# EAGLE schematic DUE3DOM MINI rev2 21022017-1546 (EAGLE 7.5.0)
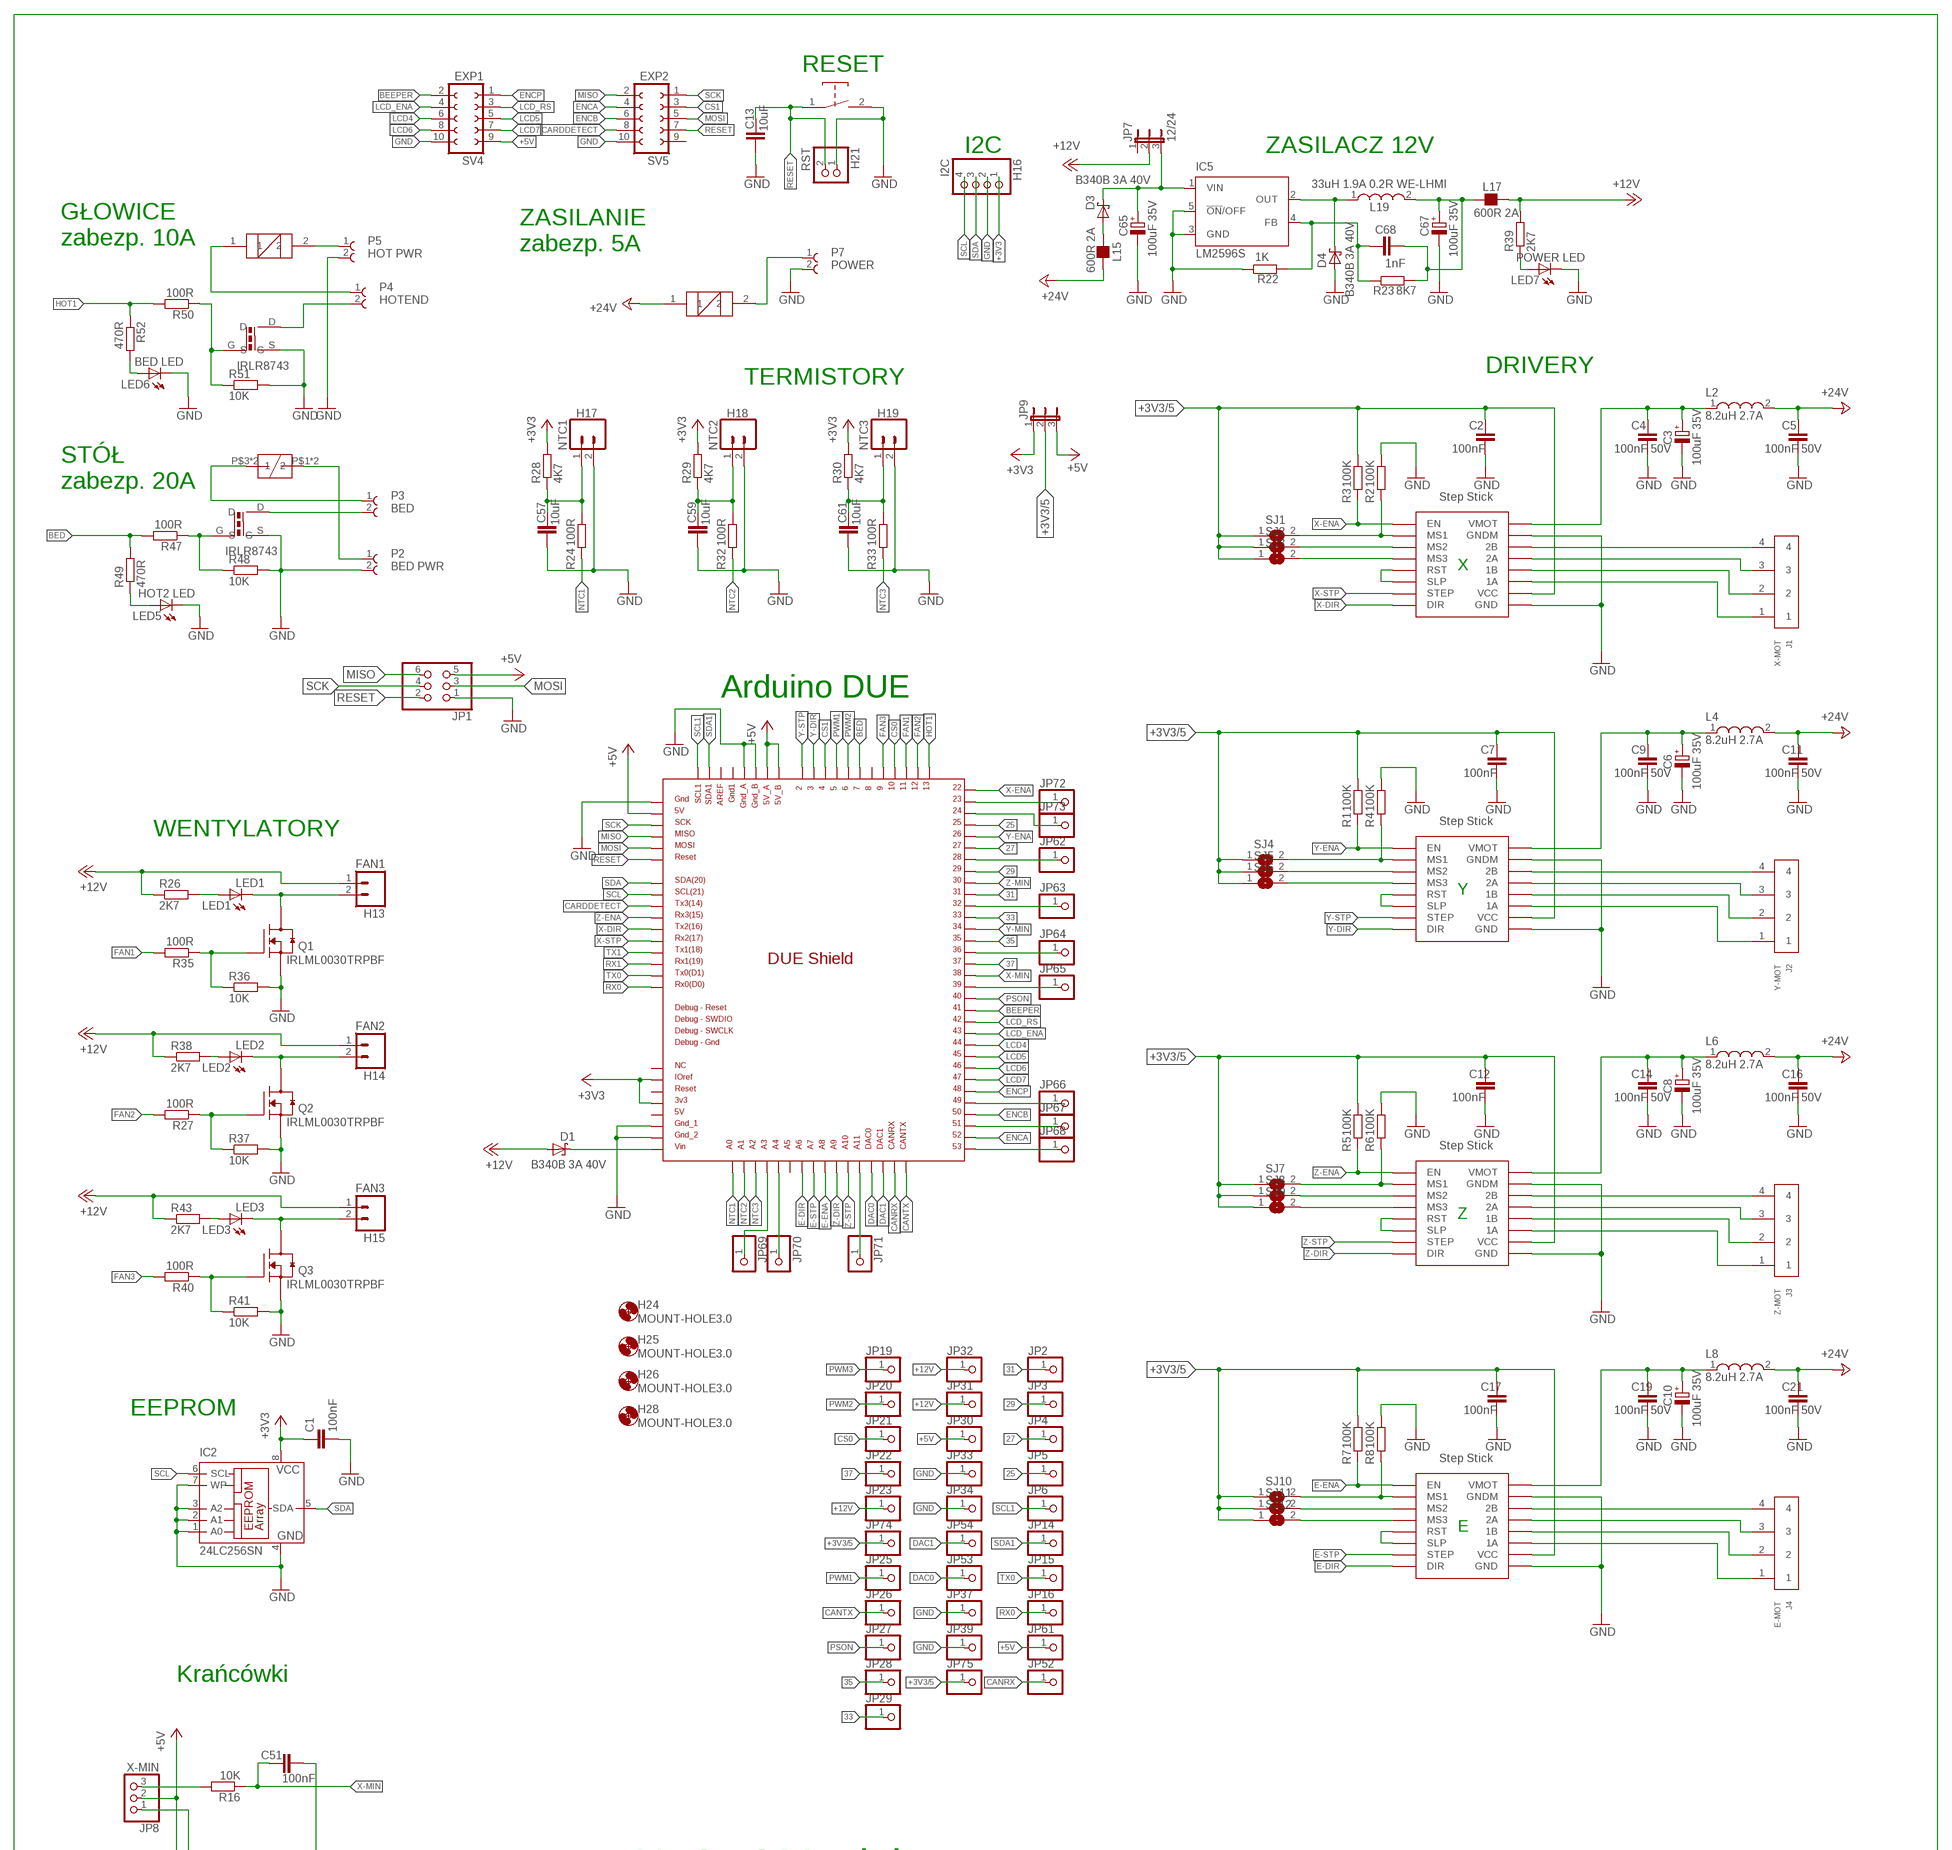
[diagram p0: schematic, sheet 1, part 1 of 2]
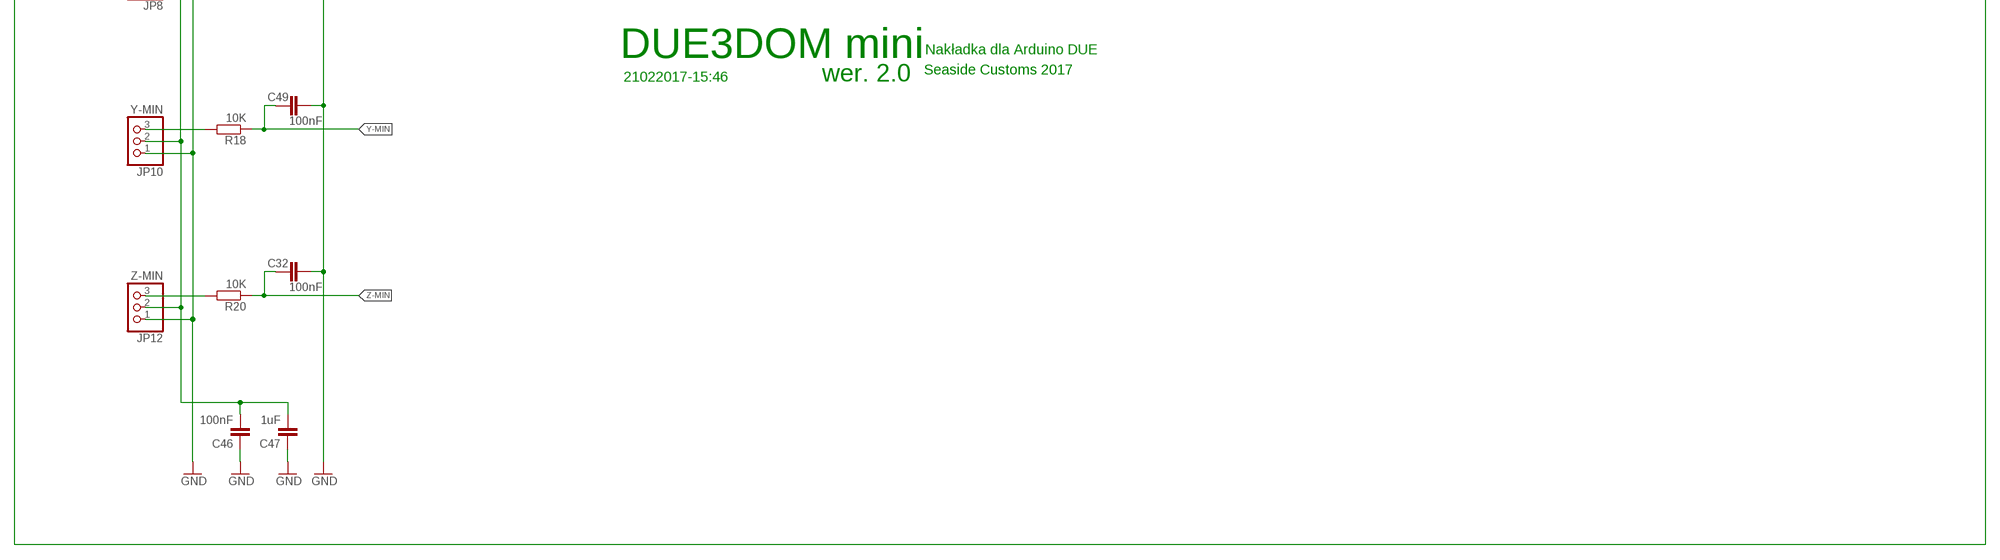
[diagram p1: schematic, sheet 1, part 2 of 2]

## Parts
C1  100nF  C-EUC0805  [C0805]
C2  100nF  C-EUC0805  [C0805]
C3  100uF 35V  CPOL-EUD  [PANASONIC_D]
C4  100nF 50V  C-EUC0805  [C0805]
C5  100nF 50V  C-EUC0805  [C0805]
C6  100uF 35V  CPOL-EUD  [PANASONIC_D]
C7  100nF  C-EUC0805  [C0805]
C8  100uF 35V  CPOL-EUD  [PANASONIC_D]
C9  100nF 50V  C-EUC0805  [C0805]
C10  100uF 35V  CPOL-EUD  [PANASONIC_D]
C11  100nF 50V  C-EUC0805  [C0805]
C12  100nF  C-EUC0805  [C0805]
C13  10uF  C-EUC0805  [C0805]
C14  100nF 50V  C-EUC0805  [C0805]
C16  100nF 50V  C-EUC0805  [C0805]
C17  100nF  C-EUC0805  [C0805]
C19  100nF 50V  C-EUC0805  [C0805]
C21  100nF 50V  C-EUC0805  [C0805]
C32  100nF  C-EUC0805  [C0805]
C46  100nF  C-EUC0805  [C0805]
C47  1uF  C-EUC0805  [C0805]
C49  100nF  C-EUC0805  [C0805]
C51  100nF  C-EUC0805  [C0805]
C57  10uF  C-EUC0805  [C0805]
C59  10uF  C-EUC0805  [C0805]
C61  10uF  C-EUC0805  [C0805]
C65  100uF 35V  CPOL-EUE2.5-6  [E2,5-6]
C67  100uF 35V  CPOL-EUE2.5-6  [E2,5-6]
C68  1nF  C-EUC0805  [C0805]
D1  B340B 3A 40V  SCHOTTKY-DIODESMD  [SMB]
D3  B340B 3A 40V  SCHOTTKY-DIODESMD  [SMB]
D4  B340B 3A 40V  SCHOTTKY-DIODESMD  [SMB]
FET1  DPAK_N-CHANNEL_MOSFET  [DPAK_N-CHANNEL_MOSFET]
FET2  DPAK_N-CHANNEL_MOSFET  [DPAK_N-CHANNEL_MOSFET]
FUSE  GNIAZDO_BEZPIECZNIKA_MINI_CHRL  [FUSE_MINI_CHRL]
H13  FAN1  M02POLAR  [MOLEX-1X2]
H14  FAN2  M02POLAR  [MOLEX-1X2]
H15  FAN3  M02POLAR  [MOLEX-1X2]
H16  I2C  PINHD-1X4  [1X04]
H17  NTC1  M02POLAR  [MOLEX-1X2]
H18  NTC2  M02POLAR  [MOLEX-1X2]
H19  NTC3  M02POLAR  [MOLEX-1X2]
H21  RST  PINHD-1X2  [1X02]
H24  MOUNT-HOLE3.0  [3,0]
H25  MOUNT-HOLE3.0  [3,0]
H26  MOUNT-HOLE3.0  [3,0]
H28  MOUNT-HOLE3.0  [3,0]
IC2  24LC256SN  [SO-08]
IC5  LM2596S  [TO263-5]
J1  X-MOT  66100411622  [66100411622]
J2  Y-MOT  66100411622  [66100411622]
J3  Z-MOT  66100411622  [66100411622]
J4  E-MOT  66100411622  [66100411622]
JP1  PINHD-2X3  [2X03]
JP2  PINHD-1X1  [1X01]
JP3  PINHD-1X1  [1X01]
JP4  PINHD-1X1  [1X01]
JP5  PINHD-1X1  [1X01]
JP6  PINHD-1X1  [1X01]
JP7  12/24  JP2E  [JP2]
JP8  X-MIN  PINHD-1X3  [1X03]
JP9  JP2E  [JP2]
JP10  Y-MIN  PINHD-1X3  [1X03]
JP12  Z-MIN  PINHD-1X3  [1X03]
JP14  PINHD-1X1  [1X01]
JP15  PINHD-1X1  [1X01]
JP16  PINHD-1X1  [1X01]
JP19  PINHD-1X1  [1X01]
JP20  PINHD-1X1  [1X01]
JP21  PINHD-1X1  [1X01]
JP22  PINHD-1X1  [1X01]
JP23  PINHD-1X1  [1X01]
JP25  PINHD-1X1  [1X01]
JP26  PINHD-1X1  [1X01]
JP27  PINHD-1X1  [1X01]
JP28  PINHD-1X1  [1X01]
JP29  PINHD-1X1  [1X01]
JP30  PINHD-1X1  [1X01]
JP31  PINHD-1X1  [1X01]
JP32  PINHD-1X1  [1X01]
JP33  PINHD-1X1  [1X01]
JP34  PINHD-1X1  [1X01]
JP37  PINHD-1X1  [1X01]
JP39  PINHD-1X1  [1X01]
JP52  PINHD-1X1  [1X01]
JP53  PINHD-1X1  [1X01]
JP54  PINHD-1X1  [1X01]
JP61  PINHD-1X1  [1X01]
JP62  PINHD-1X1  [1X01]
JP63  PINHD-1X1  [1X01]
JP64  PINHD-1X1  [1X01]
JP65  PINHD-1X1  [1X01]
JP66  PINHD-1X1  [1X01]
JP67  PINHD-1X1  [1X01]
JP68  PINHD-1X1  [1X01]
JP69  PINHD-1X1  [1X01]
JP70  PINHD-1X1  [1X01]
JP71  PINHD-1X1  [1X01]
JP72  PINHD-1X1  [1X01]
JP73  PINHD-1X1  [1X01]
JP74  PINHD-1X1  [1X01]
JP75  PINHD-1X1  [1X01]
L2  8.2uH 2.7A  WE-PD_7332/7345_PLASTIC_BASE  [WE-PD_7332/7345_PLASTIC_BASE]
L4  8.2uH 2.7A  WE-PD_7332/7345_PLASTIC_BASE  [WE-PD_7332/7345_PLASTIC_BASE]
L6  8.2uH 2.7A  WE-PD_7332/7345_PLASTIC_BASE  [WE-PD_7332/7345_PLASTIC_BASE]
L8  8.2uH 2.7A  WE-PD_7332/7345_PLASTIC_BASE  [WE-PD_7332/7345_PLASTIC_BASE]
L15  600R 2A  FB_1206  [L1206]
L17  600R 2A  FB_1206  [L1206]
L19  33uH 1.9A 0.2R WE-LHMI  WE-LHMI_7030/7050  [WE-LHMI_7030/7050]
LED1  LED1  LED_0805_BIVAR_VLP-250-F  [LED_0805_BIVAR_VLP-250-F]
LED2  LED2  LED_0805_BIVAR_VLP-250-F  [LED_0805_BIVAR_VLP-250-F]
LED3  LED3  LED_0805_BIVAR_VLP-250-F  [LED_0805_BIVAR_VLP-250-F]
LED5  HOT2 LED  LED_0805_BIVAR_VLP-250-F  [LED_0805_BIVAR_VLP-250-F]
LED6  BED LED  LED_0805_BIVAR_VLP-250-F  [LED_0805_BIVAR_VLP-250-F]
LED7  POWER LED  LED_0805_BIVAR_VLP-250-F  [LED_0805_BIVAR_VLP-250-F]
P2  BED PWR  691241710002  [691241710002]
P3  BED  691241710002  [691241710002]
P4  HOTEND  691241710002  [691241710002]
P5  HOT PWR  691241710002  [691241710002]
P7  POWER  691241710002  [691241710002]
Q1  IRLML0030TRPBF  MOSFET-NCH_SOT-23  [SOT95P280X135-3N]
Q2  IRLML0030TRPBF  MOSFET-NCH_SOT-23  [SOT95P280X135-3N]
Q3  IRLML0030TRPBF  MOSFET-NCH_SOT-23  [SOT95P280X135-3N]
R1  100K  R-EU_R0805  [R0805]
R2  100K  R-EU_R0805  [R0805]
R3  100K  R-EU_R0805  [R0805]
R4  100K  R-EU_R0805  [R0805]
R5  100K  R-EU_R0805  [R0805]
R6  100K  R-EU_R0805  [R0805]
R7  100K  R-EU_R0805  [R0805]
R8  100K  R-EU_R0805  [R0805]
R16  10K  R-EU_R0805  [R0805]
R18  10K  R-EU_R0805  [R0805]
R20  10K  R-EU_R0805  [R0805]
R22  1K  R-EU_R0805  [R0805]
R23  8K7  R-EU_R0805  [R0805]
R24  100R  R-EU_R0805  [R0805]
R26  2K7  R-EU_R0805  [R0805]
R27  100R  R-EU_R0805  [R0805]
R28  4K7  R-EU_R0805  [R0805]
R29  4K7  R-EU_R0805  [R0805]
R30  4K7  R-EU_R0805  [R0805]
R32  100R  R-EU_R0805  [R0805]
R33  100R  R-EU_R0805  [R0805]
R35  100R  R-EU_R0805  [R0805]
R36  10K  R-EU_R0805  [R0805]
R37  10K  R-EU_R0805  [R0805]
R38  2K7  R-EU_R0805  [R0805]
R39  2K7  R-EU_R0805  [R0805]
R40  100R  R-EU_R0805  [R0805]
R41  10K  R-EU_R0805  [R0805]
R43  2K7  R-EU_R0805  [R0805]
R47  100R  R-EU_R0805  [R0805]
R48  10K  R-EU_R0805  [R0805]
R49  470R  R-EU_R0805  [R0805]
R50  100R  R-EU_R0805  [R0805]
R51  10K  R-EU_R0805  [R0805]
R52  470R  R-EU_R0805  [R0805]
RESET  RESET  WIDE_TACT  [WIDE_TACT]
SJ1  SJ  [SJ]
SJ2  SJ  [SJ]
SJ3  SJ  [SJ]
SJ4  SJ  [SJ]
SJ5  SJ  [SJ]
SJ6  SJ  [SJ]
SJ7  SJ  [SJ]
SJ8  SJ  [SJ]
SJ9  SJ  [SJ]
SJ10  SJ  [SJ]
SJ11  SJ  [SJ]
SJ12  SJ  [SJ]
STEPSTICK-X  STEP-STICK  [STEP-STICK]
STEPSTICK-Y  STEP-STICK  [STEP-STICK]
STEPSTICK-Z1  STEP-STICK  [STEP-STICK]
STEPSTICK-Z2  STEP-STICK  [STEP-STICK]
SV4  EXP1  FE05-2  [FE05-2]
SV5  EXP2  FE05-2  [FE05-2]
U$1  DUE(NORMAL)  [DUE(NORMAL)]
U$2  FUSE_1808  [FUSE_1808]
U$3  FUSE_1808  [FUSE_1808]

## Nets
25: JP5.1 U$1.25
27: JP4.1 U$1.27
29: JP3.1 U$1.29
31: JP2.1 U$1.31
33: JP29.1 U$1.33
35: JP28.1 U$1.35
37: JP22.1 U$1.37
+3V3: C1.1 H16.1 IC2.8(VCC) JP9.1 R28.2 R29.2 R30.2 U$1.3V3 U$1.IOREF
+3V3/5: C2.1 C7.1 C12.1 C17.1 JP9.2 JP74.1 JP75.1 R1.1 R3.1 R5.1 R7.1 SJ1.1 SJ2.1 SJ3.1 SJ4.1 SJ5.1 SJ6.1 SJ7.1 SJ8.1 SJ9.1 SJ10.1 SJ11.1 SJ12.1 STEPSTICK-X.VDD(VCC) STEPSTICK-Y.VDD(VCC) STEPSTICK-Z1.VDD(VCC) STEPSTICK-Z2.VDD(VCC)
+5V: C46.2 C47.2 JP1.5 JP8.2 JP9.3 JP10.2 JP12.2 JP30.1 JP61.1 SV4.9 U$1.5V_A U$1.5V_B U$1.GND_ICSP
+12V: D1.A H13.1 H14.1 H15.1 JP7.2 JP23.1 JP31.1 JP32.1 L17.2 R26.1 R38.1 R39.2 R43.1
+24V: C5.1 C11.1 C16.1 C21.1 L2.2 L4.2 L6.2 L8.2 L15.1 U$3.1
BED: R47.2 R49.2 U$1.7
BEEPER: SV4.2 U$1.41
CANRX: JP52.1 U$1.CANRX
CANTX: JP26.1 U$1.CANTX
CARDDETECT: SV5.8 U$1.TX3
CS0: JP21.1 U$1.10
CS1: SV5.3 U$1.4
DAC0: JP53.1 U$1.DAC0
DAC1: JP54.1 U$1.DAC1
E-DIR: STEPSTICK-Z2.DIR U$1.A6
E-ENA: R7.2 STEPSTICK-Z2.ENABLE(EN) U$1.A8
E-STP: STEPSTICK-Z2.STP(STEP) U$1.A7
ENCA: SV5.4 U$1.52
ENCB: SV5.6 U$1.50
ENCP: SV4.1 U$1.48
FAN1: R35.2 U$1.11
FAN2: R27.2 U$1.12
FAN3: R40.2 U$1.9
GND: C1.2 C2.2 C3.- C4.2 C5.2 C6.- C7.2 C8.- C9.2 C10.- C11.2 C12.2 C13.2 C14.2 C16.2 C17.2 C19.2 C21.2 C32.1 C46.1 C47.1 C49.1 C51.1 C57.2 C59.2 C61.2 C65.- C67.- D4.A FET1.S FET2.S H16.2 H17.2 H18.2 H19.2 H21.1 IC2.1(A0) IC2.2(A1) IC2.3(A2) IC2.4(GND) IC2.7(WP) IC5.3(GND) IC5.5(!ON!/OFF) JP1.1 JP8.1 JP10.1 JP12.1 JP33.1 JP34.1 JP37.1 JP39.1 LED5.C LED6.C LED7.C P2.2 P5.2 P7.2 Q1.2(S) Q2.2(S) Q3.2(S) R2.1 R4.1 R6.1 R8.1 R22.1 R36.2 R37.2 R41.2 R48.2 R51.2 RESET.2 STEPSTICK-X.GND1(GND) STEPSTICK-X.GND(GNDM) STEPSTICK-Y.GND1(GND) STEPSTICK-Y.GND(GNDM) STEPSTICK-Z1.GND1(GND) STEPSTICK-Z1.GND(GNDM) STEPSTICK-Z2.GND1(GND) STEPSTICK-Z2.GND(GNDM) SV4.10 SV5.10 U$1.5V_ICSP U$1.GND_1 U$1.GND_2 U$1.GND_A U$1.GND_B
HOT1: R50.2 R52.1 U$1.13
LCD4: SV4.6 U$1.44
LCD5: SV4.5 U$1.45
LCD6: SV4.8 U$1.46
LCD7: SV4.7 U$1.47
LCD_ENA: SV4.4 U$1.43
LCD_RS: SV4.3 U$1.42
MISO: JP1.6 SV5.2 U$1.MISO_ICSP
MOSI: JP1.3 SV5.5 U$1.MOSI_ICSP
N$1: SJ5.2 STEPSTICK-Y.MS2
N$2: C57.1 H17.1 R24.1 R28.1
N$3: C61.1 H19.1 R30.1 R33.1
N$4: P5.1 U$2.2
N$5: STEPSTICK-X.RESET(RST) STEPSTICK-X.SLEEP(SLP)
N$6: JP62.1 U$1.28
N$7: JP63.1 U$1.32
N$8: J1.4 STEPSTICK-X.2B
N$9: FUSE.P$1 FUSE.P$2 P2.1
N$10: R2.2 SJ1.2 STEPSTICK-X.MS1
N$11: SJ2.2 STEPSTICK-X.MS2
N$12: SJ3.2 STEPSTICK-X.MS3
N$13: J1.3 STEPSTICK-X.2A
N$14: J1.2 STEPSTICK-X.1B
N$15: J1.1 STEPSTICK-X.1A
N$16: C59.1 H18.1 R29.1 R32.1
N$17: C3.+ C4.1 L2.1 STEPSTICK-X.VMOT
N$18: JP64.1 U$1.36
N$19: R4.2 SJ4.2 STEPSTICK-Y.MS1
N$20: SJ6.2 STEPSTICK-Y.MS3
N$21: SJ8.2 STEPSTICK-Z1.MS2
N$22: STEPSTICK-Y.RESET(RST) STEPSTICK-Y.SLEEP(SLP)
N$23: J2.4 STEPSTICK-Y.2B
N$24: J2.3 STEPSTICK-Y.2A
N$25: J2.2 STEPSTICK-Y.1B
N$26: J2.1 STEPSTICK-Y.1A
N$27: C6.+ C9.1 L4.1 STEPSTICK-Y.VMOT
N$28: JP65.1 U$1.39
N$29: JP8.3 R16.2
N$30: R6.2 SJ7.2 STEPSTICK-Z1.MS1
N$31: SJ9.2 STEPSTICK-Z1.MS3
N$32: SJ11.2 STEPSTICK-Z2.MS2
N$33: STEPSTICK-Z1.RESET(RST) STEPSTICK-Z1.SLEEP(SLP)
N$34: J3.4 STEPSTICK-Z1.2B
N$35: J3.3 STEPSTICK-Z1.2A
N$36: J3.2 STEPSTICK-Z1.1B
N$37: J3.1 STEPSTICK-Z1.1A
N$38: C8.+ C14.1 L6.1 STEPSTICK-Z1.VMOT
N$39: JP66.1 U$1.49
N$40: JP10.3 R18.2
N$41: R8.2 SJ10.2 STEPSTICK-Z2.MS1
N$42: SJ12.2 STEPSTICK-Z2.MS3
N$43: JP67.1 U$1.51
N$44: STEPSTICK-Z2.RESET(RST) STEPSTICK-Z2.SLEEP(SLP)
N$45: J4.4 STEPSTICK-Z2.2B
N$46: J4.3 STEPSTICK-Z2.2A
N$47: J4.2 STEPSTICK-Z2.1B
N$48: J4.1 STEPSTICK-Z2.1A
N$49: C10.+ C19.1 L8.1 STEPSTICK-Z2.VMOT
N$50: JP68.1 U$1.53
N$51: JP12.3 R20.2
N$52: JP69.1 U$1.A3
N$53: JP70.1 U$1.A4
N$54: JP71.1 U$1.A11
N$55: JP72.1 U$1.23
N$56: JP73.1 U$1.24
N$74: D1.C U$1.VIN
N$84: LED5.A R49.1
N$86: C68.1 IC5.4(FB) R22.2 R23.1
N$88: Q2.1(G) R27.1 R37.1
N$89: H14.2 LED2.C Q2.3(D)
N$90: LED2.A R38.2
N$91: Q1.1(G) R35.1 R36.1
N$95: LED6.A R52.2
N$99: D3.A L15.2
N$100: H13.2 LED1.C Q1.3(D)
N$101: LED1.A R26.2
N$102: Q3.1(G) R40.1 R41.1
N$103: H15.2 LED3.C Q3.3(D)
N$104: LED3.A R43.2
N$109: FUSE.P$3 FUSE.P$4 P3.1
N$110: FET2.G R47.1 R48.1
N$111: FET2.D P3.2
N$114: FET1.G R50.1 R51.1
N$115: FET1.D P4.2
N$117: P4.1 U$2.1
N$121: LED7.A R39.1
N$122: P7.1 U$3.2
N$129: C65.+ D3.C IC5.1(VIN) JP7.3
N$130: D4.C IC5.2(OUT) L19.1
NTC1: R24.2 U$1.A0
NTC2: R32.2 U$1.A1
NTC3: R33.2 U$1.A2
PSON: JP27.1 U$1.40
PWM1: JP25.1 U$1.5
PWM2: JP20.1 U$1.6
PWM3: JP19.1
RESET: C13.1 H21.2 JP1.2 RESET.1 SV5.7 U$1.RESET_ICSP
RX0: JP16.1 U$1.RX0
RX1: U$1.RX1
SCK: JP1.4 SV5.1 U$1.SCK_ICSP
SCL: H16.4 IC2.6(SCL) U$1.SCL
SCL1: JP6.1 U$1.SCL1
SDA: H16.3 IC2.5(SDA) U$1.SDA
SDA1: JP14.1 U$1.SDA1
SUPP1: C67.+ C68.2 L17.1 L19.2 R23.2
TX0: JP15.1 U$1.TX0
TX1: U$1.TX1
X-DIR: STEPSTICK-X.DIR U$1.TX2
X-ENA: R3.2 STEPSTICK-X.ENABLE(EN) U$1.22
X-MIN: C51.2 R16.1 U$1.38
X-STP: STEPSTICK-X.STP(STEP) U$1.RX2
Y-DIR: STEPSTICK-Y.DIR U$1.3
Y-ENA: R1.2 STEPSTICK-Y.ENABLE(EN) U$1.26
Y-MIN: C49.2 R18.1 U$1.34
Y-STP: STEPSTICK-Y.STP(STEP) U$1.2
Z-DIR: STEPSTICK-Z1.DIR U$1.A9
Z-ENA: R5.2 STEPSTICK-Z1.ENABLE(EN) U$1.RX3
Z-MIN: C32.2 R20.1 U$1.30
Z-STP: STEPSTICK-Z1.STP(STEP) U$1.A10
Unconnected: JP7.1 SV5.9 U$1.5V U$1.8 U$1.A5 U$1.AREF U$1.GND1 U$1.NC U$1.RESET

## Notes on the sheet
- RESET
- I2C | ZASILACZ 12V
- GŁOWICE
  zabezp. 10A
- ZASILANIE
  zabezp. 5A
- DRIVERY
- TERMISTORY
- STÓŁ
  zabezp. 20A
- X
- Arduino DUE
- WENTYLATORY
- Y
- Z
- EEPROM
- E
- Krańcówki
- DUE3DOM mini | Nakładka dla Arduino DUE
- Seaside Customs 2017
- 21022017-15:46 | wer. 2.0

## Library data of the parts
C1 C2 C4 C5 C7 C9 C11-C14 C16 C17 C19 C21 C32 C46 C47 C49 C51 C57 C59 C61 C68 = resistor:C-EU: CAPACITOR, European symbol
C3 C6 C8 C10 C65 C67 = resistor:CPOL-EU: POLARIZED CAPACITOR, European symbol
D1 D3 D4 = diode:SCHOTTKY-DIODE: Schottky Diode
FET1 FET2 = dpak TO252 N-channel mosfet:DPAK_N-CHANNEL_MOSFET: DPAK N-CHANNEL MOSFET
FUSE = gniazdo bezpiecznika MINI - import CHRL:GNIAZDO_BEZPIECZNIKA_MINI_CHRL: Gniazdo bezpiecznika MINI - import CHRL
H13-H15 H17-H19 = SparkFun:M02: Header 2 Standard 2-pin 0.1" header. Use with straight break away headers (SKU : PRT-00116), right angle break away headers (PRT-00553), swiss pins (PRT-00743), machine pins (PRT-00117), and female headers (PRT-00115). Molex polarized connector foot print use with SKU : PRT-08233 with associated crimp pins and housings.
H16 = pinhead:PINHD-1X4: PIN HEADER
H21 = pinhead:PINHD-1X2: PIN HEADER
H24-H26 H28 = holes:MOUNT-HOLE: MOUNTING HOLE with drill center marker
IC2 = microchip:24*: Serial EEPROM I2C; MF: MICROCHIP; MPN: 24LC256-I/SN; OC_FARNELL: 9757996; OC_NEWARK: 27C9144
IC5 = national-semiconductor:LM2596: SIMPLE SWITCHER® Power Converter 150 kHz 3A Step-Down Voltage Regulator Source: http://www.national.com/ds/LM/LM2596.pdf; MF: NATIONAL SEMICONDUCTOR; MPN: LM2596S-ADJ/NOPB; OC_FARNELL: 9494367; OC_NEWARK: 41K3842
J1-J4 = Wurth Wire to Board:66100411622: WIRE TO BOARD CONNECTION - 2.54 MM - SHROUDED HEADER - STRAIGHT - GLOW WIRE PLASTIC - WR-WTB =>ConWTB254 661004116222 Characteristics INSULATOR: PA46G15 FLAMMABILITY RATING: UL94V0 COLOR: BLACK METAL: PHOSPHOR BRONZE PLATING: TIN OVER Ni QUALITY CLASS: 25 MATING CYCLES OPERATING TEMPERATURE:-40°C UP TO +125°C COMPLIANCE: LEAD FREE AND ROHS ELECTRICAL CURRENT RATING: 3 A WORKING VOLTAGE: 50 VAC WITHSTANDING VOLTAGE: 500 VAC/MIN INSULATION RESISTANCE: >1000 MΩ CONTACT RESISTANCE: 20 mΩ MAX <http://katalog.we-online.de/media/images/v2/Family_WR-WTB_6610xx11622_2%2054.jpg> Details see: http://katalog.we-online.de/en/em/WTB_2_54_MALE_HORIZONTAL_SHROUDED_HEADER_GLOW_WIRE_PLASTIC_6610XXX1622 2015 (C) Wurth Elektronik
JP1 = pinhead:PINHD-2X3: PIN HEADER
JP2-JP6 JP14-JP16 JP19-JP23 JP25-JP34 JP37 JP39 JP52-JP54 JP61-JP75 = pinhead:PINHD-1X1: PIN HEADER
JP7 JP9 = jumper:JP2E: JUMPER
JP8 JP10 JP12 = adafruit:PINHD-1X3: PIN HEADER
L2 L4 L6 L8 = Wurth Passive:WE-PD: SMD Shielded Power Inductor Characteristics Magnetically shielded version which results in a low leakage field High Saturation currents up to 25 A Very low self-losses at high switching frequency‘s Wide inductances spectrum available at all sizes Operating temperature: –40 °C to +125 °C Applications Perfectly suitable for switching regulators with extremely high efficiency Integrated DC/DC- converter Switching regulators with low operating voltages (Graphic cards, embedded PC-Cards, Mainboards) Plastic base: Because of the one piece construction these are more suitable for high vibration or shock applications <http://katalog.we-online.de/media/images/eisos/FePBF_pf2.jpg> Details see: http://katalog.we-online.de/en/pbs/WE-PD? Updated by Dan Xu 2014-07-08 2014 (C) Wurth Elektronik
L15 L17 = rc-master-smd:FB_: FERRITE BEAD
L19 = Wurth Passive:WE-LHMI: SMD Low Profile High Current Molded Inductor Characteristics Compact design Magnetically shielded High current capability Handles high transient current spikes No acoustic noise and no leakage field Frequency range up to 5 MHz Operating temperature: –40 °C to +125 °C Applications DC/DC converters for high current power supplies DC/DC converters for Field Programmable Gate Array (FPGA) POL converters Portable power like PDA, digital cameras Mainboards/graphic cards Battery powered devices <http://katalog.we-online.de/media/images/eisos/IndLHMI_pf2.jpg> Details see: http://katalog.we-online.de/en/pbs/WE-LHMI? Updated by Dan Xu 2014-07-08 2014 (C) Wurth Elektronik
LED1-LED3 LED5-LED7 = led0805 + światłowód bivar VLP-250-F:LED_0805_BIVAR_VLP-250-F
P2-P5 P7 = Wurth Terminal Block:691241710002: SERIE 2417 - 5.00 MM - HORIZONTAL CABLE ENTRY WITH RISING CAGE CLAMP - WR-TBL =>ConTBL2 691241710002 Characteristics INSULATOR:PA6/66 FLAMABILITY RATING: UL94V0 COLOR: GREEN METAL HOUSING: COPPER ALLOY / Ni+Sn TERMINAL SCREW: STEEL / Zn WIRE GUARD: COPPER ALLOY / Ni+Sn FLANGES NUT: BRASS M2.5 OPERATING TEMPERATURE:-30°C UP TO +120°C COMPLIANCE: LEAD FREE AND ROHS ELECTRICAL UL VDE CURRENT RATING: 14A 14A WORKING VOLTAGE: 300VAC 250VAC WITHSTANDING VOLTAGE: 1,6KV 2KV CONTACT RESISTANCE: 20 mOhm max <http://katalog.we-online.de/media/images/v2/Family_WR-TBL_5_00_2417_HORIZONTAL_CABLE_ENTRY_6912417100XX.jpg> Details see: http://katalog.we-online.de/en/em/TBL_5_00_2417_HORIZONTAL_CABLE_ENTRY_W_RISING_CLAMP_6912417100XX 2015 (C) Wurth Elektronik
Q1-Q3 = ipc-7351-transistor:MOSFET-NCH_
R1-R8 R16 R18 R20 R22-R24 R26-R30 R32 R33 R35-R41 R43 R47-R52 = resistor:R-EU_: RESISTOR, European symbol
RESET = wide_tactwitch:WIDE_TACT
SJ1-SJ12 = jumper:SJ: SMD solder JUMPER
STEPSTICK-X STEPSTICK-Y STEPSTICK-Z1 STEPSTICK-Z2 = Arduino library Stepstick:STEP-STICK: Poprawiona biblioteka przez: Krzysztof Dymianiuk Poprzednia wersja była zrobiona w odbiciu lustrzanym
SV4 SV5 = con-lsta:FE05-2: FEMALE HEADER; OC_FARNELL: unknown; OC_NEWARK: unknown
U$1 = Arduino_DUE_bez_opisow:DUE(NORMAL)
U$2 U$3 = fuse 1808:FUSE_1808: Bezpiecznik 1808 w obudowie